# EAGLE design watch (EAGLE 7.0.0)
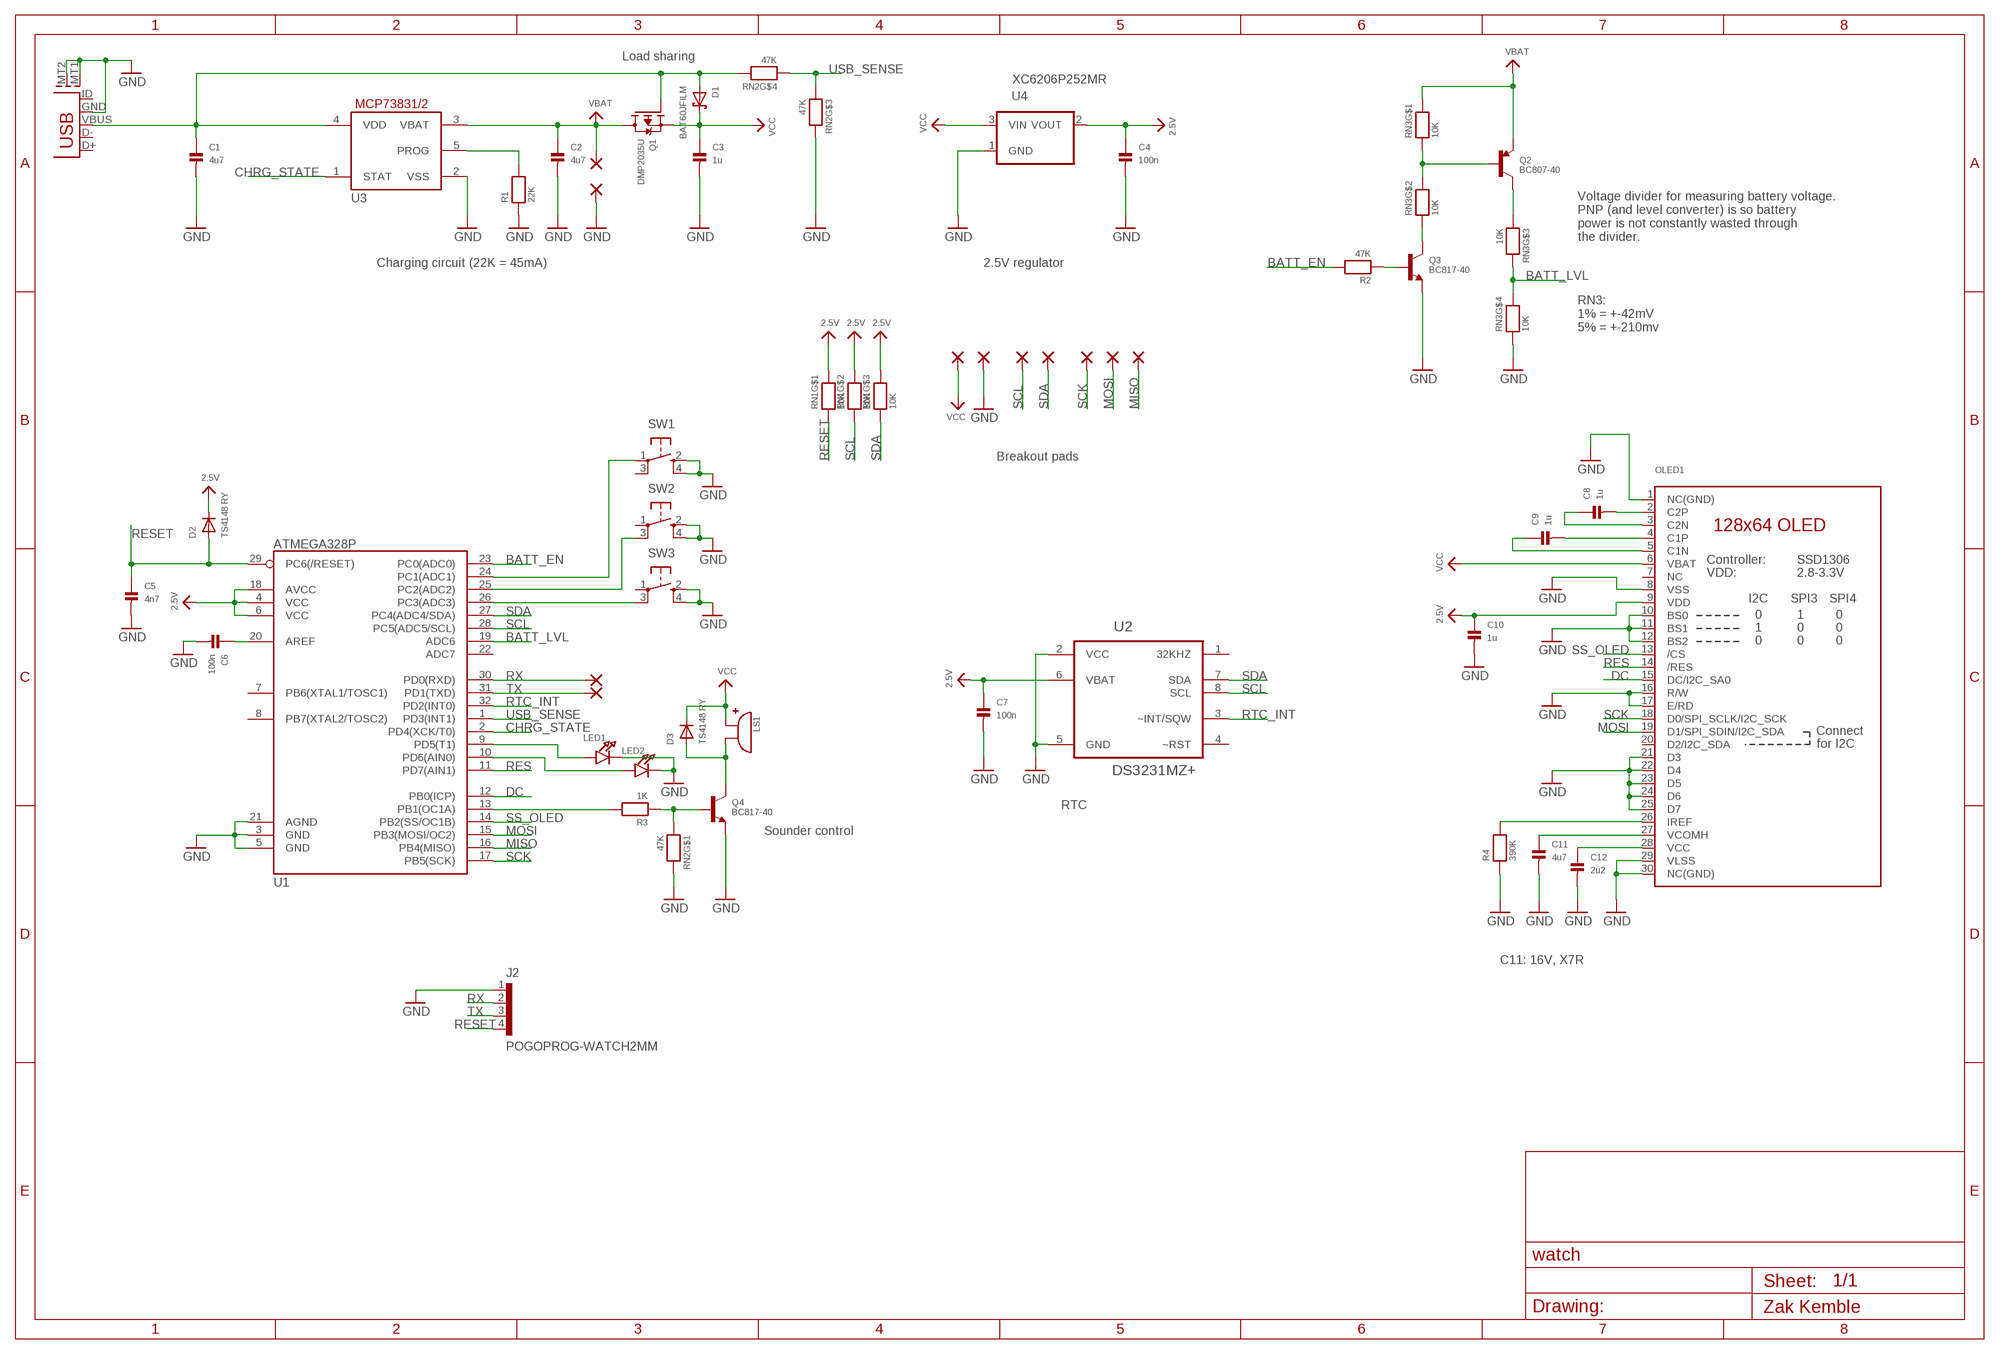
[diagram p0: schematic, sheet 1]

## Parts
C1  4u7  CAP_CERAMIC0805  [0805]
C2  4u7  CAP_CERAMIC0805  [0805]
C3  1u  CAP_CERAMIC0805  [0805]
C4  100n  CAP_CERAMIC0805  [0805]
C5  4n7  CAP_CERAMIC0805  [0805]
C6  100n  CAP_CERAMIC0805  [0805]
C7  100n  CAP_CERAMIC0805  [0805]
C8  1u  CAP_CERAMIC0805  [0805]
C9  1u  CAP_CERAMIC0805  [0805]
C10  1u  CAP_CERAMIC0805  [0805]
C11  4u7  CAP_CERAMIC0805  [0805]
C12  2u2  CAP_CERAMIC0805  [0805]
D1  BAT60JFILM  DIODE-SCHOTTKYSOD-323  [SOD-323]
D2  TS4148 RY  DIODE_08050805  [0805_DIODE]
D3  TS4148 RY  DIODE_08050805  [0805_DIODE]
J2  POGOPROG-WATCH2MM  [POGOPROG_WATCH_2MM]
LED1  LED0805  [CHIPLED_0805]
LED2  LED0805  [CHIPLED_0805]
LS1  ABMT-801-RC  [PIEZO]
OLED1  DISP_OLED_UG-2864HSWEG01_NOOUTLINEWATCH  [UG-2864HSWEG01_1.3_WRAPAROUND_WATCH]
PAD1  SMD2  [SMD1,27-2,54]
PAD2  SMD2  [SMD1,27-2,54]
PAD3  SMD2  [SMD1,27-2,54]
PAD4  SMD2  [SMD1,27-2,54]
PAD5  SMD2  [SMD1,27-2,54]
PAD6  SMD2  [SMD1,27-2,54]
PAD7  SMD2  [SMD1,27-2,54]
PAD8  SMD2  [SMD1,27-2,54]
PAD10  SMD2  [SMD1,27-2,54]
PAD11  SMD2  [SMD1,27-2,54]
PAD12  SMD2  [SMD1,27-2,54]
Q1  DMP2035U  MOSFET-PWIDE  [SOT23-WIDE]
Q2  BC807-40  TRANSISTOR_PNPWIDE  [SOT23-WIDE]
Q3  BC817-40  TRANSISTOR_NPNWIDE  [SOT23-WIDE]
Q4  BC817-40  TRANSISTOR_NPNWIDE  [SOT23-WIDE]
R1  22K  RESISTOR0805  [0805]
R2  47K  RESISTOR0805  [0805]
R3  1K  RESISTOR0805  [0805]
R4  390K  RESISTOR0805  [0805]
RN1  10K  RESISTOR_4PACK  [RESPACK_4X0603]
RN2  47K  RESISTOR_4PACK  [RESPACK_4X0603]
RN3  10K  RESISTOR_4PACK  [RESPACK_4X0603]
SW1  SPST_TACTRA  [TACT_SMD2]
SW2  SPST_TACTRA  [TACT_SMD2]
SW3  SPST_TACTRA  [TACT_SMD2]
U1  ATMEGA328P  ATMEGA328_SMT  [TQFP32-08]
U2  DS3231MZ+  DS3231MZ+SMPAD  [SOIC8_150MIL_SMPAD]
U3  MCP73832T-2ACI/OT  MCP73831/OT  [SOT23-5L]
U4  XC6206P252MR  MCP1700T-2502E/TTWIDE_PAD  [SOT-23]
USB1  USB-MICROBLARGEPAD  [USB-MICROB_LARGEPAD]

## Nets
2.5V: C4.1 C7.1 C10.1 D2.2(C) OLED1.9(VDD) RN1.6 RN1.7 RN1.8 U1.4(VCC) U1.6(VCC) U1.18(AVCC) U2.6(VBAT) U4.2(VOUT)
BATT_EN: R2.2 U1.23(PC0(ADC0))
BATT_LVL: RN3.5 RN3.6 U1.19(ADC6)
CHRG_STATE: U1.2(PD4(XCK/T0)) U3.1(STAT)
DC: OLED1.15(DC/I2C_SA0) U1.12(PB0(ICP))
GND: C1.2 C2.2 C3.2 C4.2 C5.2 C6.2 C7.2 C10.2 C11.2 C12.2 J2.1 LED1.C LED2.C OLED1.1(NC(GND)) OLED1.8(VSS) OLED1.10(BS0) OLED1.11(BS1) OLED1.12(BS2) OLED1.16(R/W) OLED1.17(E/RD) OLED1.21(D3) OLED1.22(D4) OLED1.23(D5) OLED1.24(D6) OLED1.25(D7) OLED1.29(VLSS) OLED1.30(NC(GND)) PAD2.1(P) PAD5.1(P) Q3.2(E) Q4.2(E) R1.1 R4.1 RN2.6 RN2.8 RN3.4 SW1.2(S) SW1.4(S1) SW2.2(S) SW2.4(S1) SW3.2(S) SW3.4(S1) U1.3(GND) U1.5(GND) U1.21(AGND) U2.2(VCC) U2.5(GND) U3.2(VSS) U4.1(GND) USB1.GND USB1.MT1(SHEILD1) USB1.MT2(SHEILD2)
MISO: PAD12.1(P) U1.16(PB4(MISO))
MOSI: OLED1.19(D1/SPI_SDIN/I2C_SDA) PAD11.1(P) U1.15(PB3(MOSI/OC2))
N$1: C6.1 U1.20(AREF)
N$2: SW1.1(P) U1.24(PC1(ADC1))
N$3: C8.2 OLED1.2(C2P)
N$4: SW3.3(P1) U1.26(PC3(ADC3))
N$5: OLED1.26(IREF) R4.2
N$6: C1.1 D1.A Q1.1(G) RN2.5 U3.4(VDD) USB1.VBUS
N$7: D3.1(A) LS1.2(GND) Q4.3(C)
N$8: Q4.1(B) R3.1 RN2.1
N$9: SW2.3(P1) U1.25(PC2(ADC2))
N$10: R1.2 U3.5(PROG)
N$11: LED1.A U1.9(PD5(T1))
N$12: Q2.1(B) RN3.1 RN3.7
N$13: C9.1 OLED1.5(C1N)
N$14: C9.2 OLED1.4(C1P)
N$15: C8.1 OLED1.3(C2N)
N$16: LED2.A U1.10(PD6(AIN0))
N$17: Q3.3(C) RN3.2
N$18: Q2.3(C) RN3.3
N$19: C11.1 OLED1.27(VCOMH)
N$20: C12.1 OLED1.28(VCC)
N$21: Q3.1(B) R2.1
PIEZO: R3.2 U1.13(PB1(OC1A))
RES: OLED1.14(/RES) U1.11(PD7(AIN1))
RESET: C5.1 D2.1(A) J2.4 RN1.1 U1.29(PC6(/RESET))
RTC_INT: U1.32(PD2(INT0)) U2.3(~INT/SQW)
RX: J2.2 PAD3.1(P) U1.30(PD0(RXD))
SCK: OLED1.18(D0/SPI_SCLK/I2C_SCK) PAD10.1(P) U1.17(PB5(SCK))
SCL: PAD8.1(P) RN1.2 U1.28(PC5(ADC5/SCL)) U2.8(SCL)
SDA: PAD7.1(P) RN1.3 U1.27(PC4(ADC4/SDA)) U2.7(SDA)
SS_OLED: OLED1.13(/CS) U1.14(PB2(SS/OC1B))
TX: J2.3 PAD4.1(P) U1.31(PD1(TXD))
USB_SENSE: RN2.3 RN2.4 U1.1(PD3(INT1))
VBAT: C2.1 PAD1.1(P) Q1.3(D) Q2.2(E) RN3.8 U3.3(VBAT)
VCC: C3.1 D1.C D3.2(C) LS1.1(VCC) OLED1.6(VBAT) PAD6.1(P) Q1.2(S) U4.3(VIN)
Unconnected: OLED1.7(NC) OLED1.20(D2/I2C_SDA) RN1.4 RN1.5 RN2.2 RN2.7 SW1.3(P1) SW2.1(P) SW3.1(P) U1.7(PB6(XTAL1/TOSC1)) U1.8(PB7(XTAL2/TOSC2)) U1.22(ADC7) U2.1(32KHZ) U2.4(~RST) USB1.D+ USB1.D- USB1.ID

## Notes on the sheet
- Load sharing
- Voltage divider for measuring battery voltage.
  PNP (and level converter) is so battery
  power is not constantly wasted through
  the divider.
- Charging circuit (22K = 45mA) | 2.5V regulator
- RN3:
  1% = +-42mV
  5% = +-210mv
- Breakout pads
- RTC
- Sounder control
- C11: 16V, X7R

## Library data of the parts
C1-C12 = microbuilder:CAP_CERAMIC: Ceramic Capacitors 0402 - 0402 Surface Mount Capacitors 16pF 50V 5% [Digikey: 445-4899-2-ND] 18pF 50V 5% [Digikey: 490-1281-2-ND] 22pF 50V 5% [Digikey: 490-1283-2-ND] 68pF 50V 5% [Digikey: 490-1289-2-ND] 0.1uF 10V 10% [Digikey: 490-1318-2-ND] 1.0uF 6.3V 10% [Digikey: 490-1320-2-ND] 0603 - 0603 Surface Mount Capacitors 16 pF 50V 5% [Digikey: 445-5051-2-ND] 22 pF 50V [Digikey: PCC220ACVTR-ND] 33 pF 50V 5% [Digikey: 490-1415-1-ND] 56pF 50V 5% [Digikey: 490-1421-1-ND] 220pF 50V 5% [Digikey: 445-1285-1-ND] 680 pF 50V 2200 pF 50V 5% C0G [Digikey: 445-1297-1-ND] 5600 pF 100V 5% X7R [Digikey: 478-3711-1-ND] 0.1 µF 25V 10% [Digikey: PCC2277TR-ND] 0.22 µF 16V 10% X7R [Digikey: 445-1318-1-ND] 1.0 µF 25V 10% [Digikey: 445-5146-2-ND] 0603 - RF Specific 3pF 250V +/-0.1pF RF [Digikey: 712-1347-1-ND] 18 pF 250V 5% [Digikey: 478-3505-1-ND or 712-1322-1-ND] 56 pF 250V 5% C0G RF [Digikey: 490-4867-1-ND] 68 pF 250V RF [Digikey: 490-4868-1-ND] 0805 - 0805 Surface Mount Capacitors 220 pF 250V 2% RF Ceramic Capacitor [Digikey: 712-1398-1-ND] 1000 pF 50V 2% NP0 Ceramic Capacitor [Digikey: 478-3760-1-ND] 0.1 µF 25V 10% Ceramic Capacitor [Digikey: PCC1828TR-ND] 1.0 µF 16V 10% Ceramic Capacitor[Digikey: 490-1691-2-ND] 10.0 µF 10V 10% Ceramic Capacitor[Digikey: 709-1228-1-ND] 10.0 uF 16V 10% Ceramic Capacitor [Digikey: 478-5165-2-ND] 47 uF 6.3V 20% Ceramic Capacitor [Digikey: 587-1779-1-ND or 399-5506-1-ND] 1206 - 1206 Surface Mount Capacitors 47uF 10V 20% Ceramic Capacitor [Digikey: 490-5528-1-ND or 399-5508-1-ND or 445-6010-1-ND] 100uF 6.3V -20%, +80% Y5V Ceramic Capacitor (Digikey: 490-4512-1-ND, Mouser: 81-GRM31CF50J107ZE1L)
D1 = zak:DIODE-SCHOTTKY
D2 D3 = zak:DIODE_0805: Diode in 0805 package
J2 = zak:POGOPROG-WATCH
LED1 LED2 = microbuilder:LED: LED 0603 - 0603 Surface Mount Package 2mA: Green LED - Low Power (3.9mcd, 2ma, 1.7Vf) - Digikey: 475-2709-2-ND Orange LED - Low Power (9.8mcd, 2ma, 1.8Vf) - Digikey: 475-1194-2-ND Red LED - Low Power (5mcd, 2ma, 1.8Vf) - Digikey: 475-1195-2-ND Yellow LED - Low Power (7mcd, 2ma, 1.8Vf) - Digikey: 475-1196-2-ND 5mA: Blue LED - Low Power (17mcd, 5ma, 2.9Vf) - Digikey: LNJ937W8CRACT-ND 0805 - 0805 Surface Mount Package 2mA: Red LED (8.8mcd, 2mA, 1.8Vf, Clear) - Low Power [Digikey: 475-2510-1-ND] Green LED (5mcd, 2mA, 1.8Vf, Clear) - Low Power [Digikey: 475-2730-1-ND] Yellow LED (11.3mcd, 2mA, 1.8Vf, Clear) - Low Power [Digikey: 475-2555-1-ND] 20mA: Red LED (104mcd, 20mA, Diffused) - LS R976 [Digikey: 475-1278-6-ND] Red LED (12mcd, 20mA, 2.0Vf, Clear) - APT2012EC [Digikey: 754-1128-1-ND] Green LED (15mcd, 20mA, 2.2Vf, Clear) - APT2012GC [Digikey: 754-1131-1-ND] Orange LED (160mcd, 20mA, 2.1Vf, Clear) - APT2012SECK [Digikey: 754-1130-1-ND] 1206 - 1206 Surface Mount Package Green LED (26mcd, 20mA, Diffused) - LG N971 [Digikey: 475-1407-6-ND] Red LED (15mcd, 20mA, Diffused) - LH N974 [Digikey: 475-1416-6-ND]
LS1 = zak:ABMT-801-RC
OLED1 = zak:DISP_OLED_UG-2864HSWEG01_NOOUTLINE
PAD1-PAD8 PAD10-PAD12 = wirepad:SMD2: SMD PAD
Q1 = microbuilder:MOSFET-P: P-Channel Mosfet LEGEND VDS: Voltage Drain-Source ID: Drain Current RDS(ON): Drain-Source On-State Resistance VGS(TH): Gate-Source Threshold Voltage CISS: Drain-Source Input Capacitance SOT-23 Name VDS ID RDS(ON) VGS(TH) CISS Order Number IRLML5103 30V 760mA 600 mOhm -- 75pF @ 25V Digikey: IRLML5103PBFCT-ND IRLML6401 12V 4.3A 50 mOhm 950mV @ 250µA 830pF @ 10V Digikey: IRLML6401PBFTR-ND NTR0202PL 20V 400mA 800 mOhm 2.3V @ 250uA 70pF @ 5V Digikey: NTR0202PLT1GOSTR-ND NTR4101PT1G 20V 1.8A 85 mOhm 1.2V @ 250uA 675pF @ 10V Digikey: NTR4101PT1GOSCT-ND DMP2004K 20V 600mA 900 mOhm 1V @ 250uA 175pF @ 16V Digikey: DMP2004KDICT-ND PMV65XP 20V 3.9A 76 mOhm 950mV @ 1mA 725pF @ 20V Digikey: 568-2358-2-ND TO-252 Name VDS ID RDS(ON) VGS(TH) CISS Order Number AOD417 30V 25A 34 mOhm 3V @ 250µA 920pF @ 15V Digikey: 785-1106-2-ND
Q2 = microbuilder:TRANSISTOR_PNP: PNP Transistor Transistor (PNP) 800mA 60V, 1.6V VCE @ 500mA [Digikey: MMBT2907AFSTR-ND] Transistor (PNP) Low Sat - 1.5A 20V, 260mV VCE @ 400mA [Digikey: ZXTP25020DFLTR-ND] SOT23-R - SOT23 footprint optimised for use with solder paste and reflow ovens. SOT23-W - SOT23 footprint optimised for hand-soldering (larger pads).
Q3 Q4 = microbuilder:TRANSISTOR_NPN: NPN Transistor Transistor (NPN) 500mA 45V - BC817 [Digikey: 568-1631-1-ND] Transistor (NPN) 500mA 45V - BC817,215 [Mouser: 771-BC817-T/R] SOT23-R - SOT23 footprint optimised for use with solder paste and reflow ovens. SOT23-W - SOT23 footprint optimised for hand-soldering (larger pads).
R1-R4 = microbuilder:RESISTOR: Resistors 0402 - 0402 Surface Mount Package 22 Ohm 1% 1/16W [Digikey: 311-22.0LRTR-ND] 33 Ohm 5% 1/16W 1.0K 5% 1/16W 1.5K 5% 1/16W 2.0K 1% 1/16W 10.0K 1% 1/16W [Digikey: 311-10.0KLRTR-ND] 10.0K 5% 1/16W [Digikey: RMCF0402JT10K0TR-ND] 12.1K 1% 1/16W [Digikey: 311-22.0LRTR-ND] 100.0K 5% 1/16W 0603 - 0603 Surface Mount Package 0 Ohm 1/10 Watt 1% Resistor 15 Ohm 1/10 Watt 1% Resistor 33 Ohm 1/10 Watt 1% Resistor 49.9 Ohm 1/10 Watt 1% Resistor 100 Ohm 1/10 Watt 1% Resistor 150 Ohm 1/10 Watt 1% Resistor 240 Ohm 1/10 Watt 1% Resistor 390 Ohm 1/10 Watt 1% Resistor 560 Ohm 1/10 Watt 1% Resistor 680 Ohm 1/10 Watt 1% Resistor 750 Ohm 1/10 Watt 1% Resistor 1.0K Ohm 1/10 Watt 1% Resistor 1.5K Ohm 1/10 Watt 1% Resistor 2.0K Ohm 1/10 Watt 1% Resistor 2.2K Ohm 1/10 Watt 1% Resistor 3.3K Ohm 1/10 Watt 1% Resistor 4.7K Ohm 1/10 Watt 1% Resistor 10.0K Ohm 1/10 Watt 1% Resistor 12.0K Ohm 1/10 Watt 1% Resistor 12.1K Ohm 1/10 Watt 1% Resistor 20.0K Ohm 1/10 Watt 1% Resistor 33.0K Ohm 1/10 Watt 1% Resistor 100.0K Ohm 1/10 Watt 1% Resistor 0805 - 0805 Surface Mount Package 0 Ohm 1/8 Watt 1% Resistor 33 Ohm 1/8 Watt 1% Resistor 100 Ohm 1/8 Watt 1% Resistor 150 Ohm 1/8 Watt 1% Resistor 200 Ohm 1/8 Watt 1% Resistor 240 Ohm 1/8 Watt 1% Resistor 330 Ohm 1/8 Watt 1% Resistor 390 Ohm 1/8 Watt 1% Resistor 470 Ohm 1/8 Watt 1% Resistor 1.0K Ohm 1/8 Watt 1% Resistor 1.5K Ohm 1/8 Watt 1% Resistor 2.0K Ohm 1/8 Watt 1% Resistor 4.7K Ohm 1/8 Watt 1% Resistor 5.1K Ohm 1/8 Watt 1% Resistor 5.6K Ohm 1/8 Watt 1% Resistor 10.0K Ohm 1/8 Watt 1% Resistor 22.0K Ohm 1/8 Watt 1% Resistor 33.0K Ohm 1/8 Watt 1% Resistor 100K Ohm 1/8 Watt 1% Resistor 1206 - 1206 Surface Mount Package 2012 - 2010 Surface Mount Package 0.11 Ohm 1/2 Watt 1% Resistor - Digikey: RHM.11UCT-ND
RN1-RN3 = microbuilder:RESISTOR_4PACK: Resistor Packs (4 resistors) 4 x 0603 10K 1/16W - Digikey: YC164J-10KCT-ND
SW1-SW3 = zak:SPST_TACT
U1 = SparkFun-DigitalIC:ATMEGA328_SMT: 32-Pin Atmega328 part Commonly used on Arduino compatible boards Available in QFP and QFN packages TQFP is IC-09069 QFN is non-stock; PROD_ID: IC-09069
U2 = zak:DS3231MZ+
U3 = adafruit:MCP73831: MCP73831/2 Miniature Single-Cell, Fully Integrated Li-Ion, Li-Polymer Charge Management Controllers. Nice and small simple lipoly charge controller, with adjustable current and status output (LED) http://www.ladyada.net/library/pcb/eaglelibrary.html
U4 = zak:MCP1700T-2502E/TT: Low Quiescent Current LDO
USB1 = zak:USB-MICROB

## Board
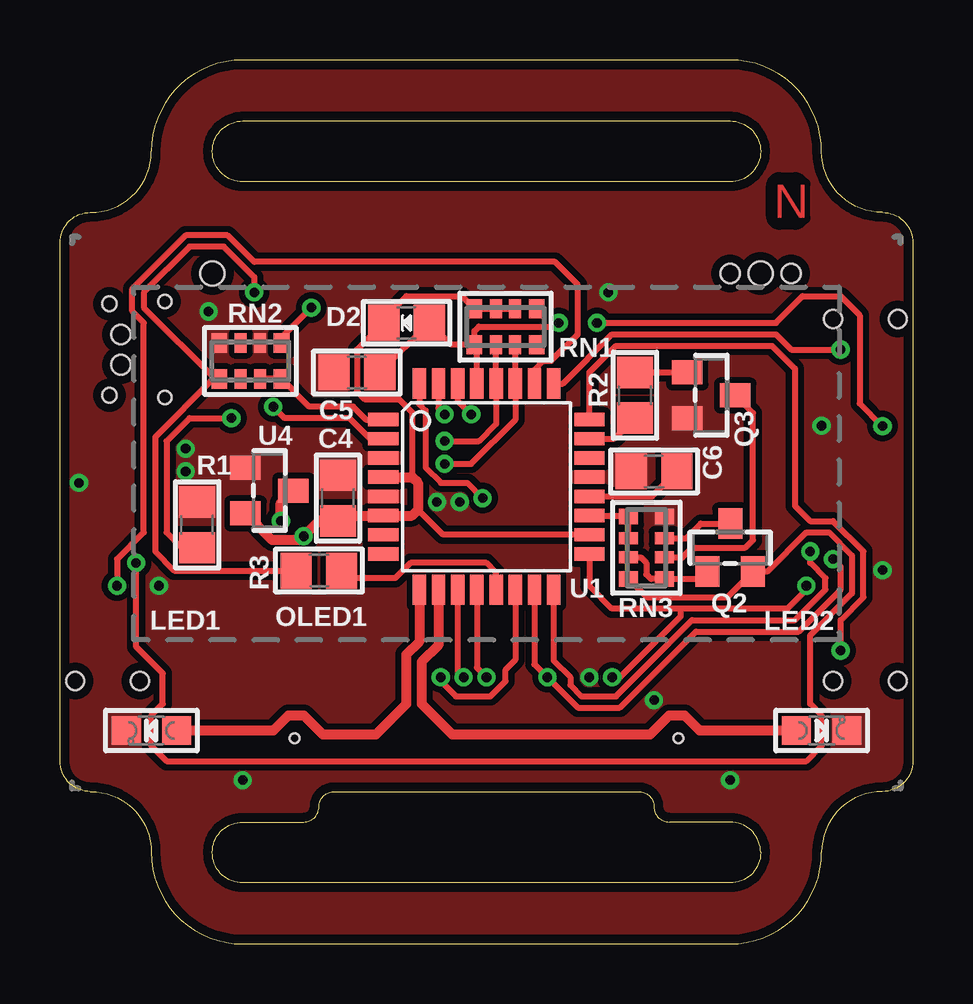
[diagram p1: board, top side]
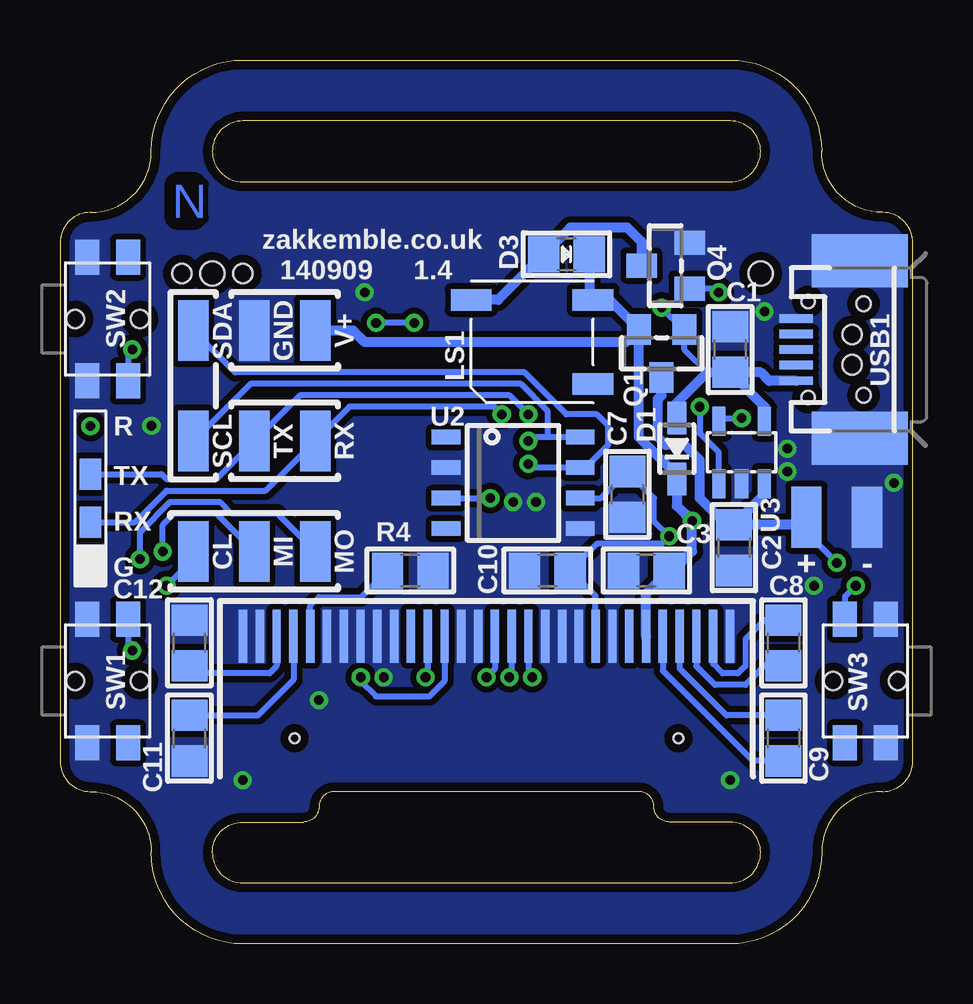
[diagram p2: board, bottom side, seen from below]

Size 35.56 x 36.83 mm. Coordinates in mm from the lower left corner, seen from the top.
Outline: 34.29,30.48 arc-90 35.56,29.21 35.56,7.62 arc-90 34.29,6.35 arc90 31.75,3.81 arc-90 27.94,0 7.62,0 arc-90 3.81,3.81 arc90 1.27,6.35 arc-90 0,7.62 0,29.21 arc-90 1.27,30.48 arc90 3.81,33.02 arc-90 7.62,36.83 27.94,36.83 arc-90 31.75,33.02 arc90 34.29,30.48
Outline: 7.62,2.54 arc-90 6.35,3.81 arc-90 7.62,5.08 10.16,5.08 arc90 10.79,5.71 arc-90 11.43,6.35 24.13,6.35 arc-90 24.76,5.71 arc90 25.4,5.08 27.94,5.08 arc-90 29.21,3.81 arc-90 27.94,2.54 7.62,2.54
Outline: 27.94,34.29 arc-90 29.21,33.02 arc-90 27.94,31.75 7.62,31.75 arc-90 6.35,33.02 arc-90 7.62,34.29 27.94,34.29
Copper layers (1*16): Top 0.0356mm / dielectric 1.5011mm / Bottom 0.0356mm
Design rules "LaenPCBOrder *": minimum track width 6mil, minimum drill 13mil, track to track 6mil, track to pad 6mil, pad to pad 6mil, via to via 6mil, smd to smd 6mil, copper to edge 15mil, drill to drill 6mil, minimum pad ring 7mil, minimum via ring 7mil, stop-mask expansion 4mil, vias tented up to drill 24mil, thermal gap 10mil
Holes 1 mm at 6.35,27.94 29.21,27.94
Holes 0.6 mm at 2.06,26.67 2.06,22.86
Holes 0.8 mm at 27.94,27.94 30.48,27.94 2.54,24.13 2.54,25.4
tRestrict: area 29.7,30 to 31,31.9
bRestrict: area 29.7,30 to 31,31.9

### Footprints (pad centres in the part's own frame; a part is rotated, then mirrored left to right if it is on the bottom)
0805 = smd 1.3 x 1.5: 1 -0.95,0; 2 0.95,0
SOD-323 = smd 1.35 x 0.8: A 1.27,0; C -1.27,0
0805_DIODE = smd 1.3 x 1.5: 1 -0.95,0; 2 0.95,0
POGOPROG_WATCH_2MM = drill 0.4: 1 0,3; 4 0,-3 | smd 0.889 x 1.3: 2 0,1; 3 0,-1
CHIPLED_0805 = smd 1.2 x 1.2: A 0,-1.05; C 0,1.05
PIEZO = smd 1.7 x 0.9: 1 -2.54,-1.75; 2 2.54,-1.75; 3 -2.54,1.75
UG-2864HSWEG01_1.3_WRAPAROUND_WATCH = smd 0.35 x 2.2 bottom: 1 -10.15,-1.153; 2 -9.45,-1.153; 3 -8.75,-1.153; 4 -8.05,-1.153; 5 -7.35,-1.153; 6 -6.65,-1.153; 7 -5.95,-1.153; 8 -5.25,-1.153; 9 -4.55,-1.153; 10 -3.85,-1.153; 11 -3.15,-1.153; 12 -2.45,-1.153; 13 -1.75,-1.153; 14 -1.05,-1.153; 15 -0.35,-1.153; 16 0.35,-1.153; 17 1.05,-1.153; 18 1.75,-1.153; 19 2.45,-1.153; 20 3.15,-1.153; 21 3.85,-1.153; 22 4.55,-1.153; 23 5.25,-1.153; 24 5.95,-1.153; 25 6.65,-1.153; 26 7.35,-1.153; 27 8.05,-1.153; 28 8.75,-1.153; 29 9.45,-1.153; 30 10.15,-1.153 | hole 0.4: -8,-5.402; 8,-5.402
SMD1,27-2,54 = smd 1.27 x 2.54: 1 0,0
SOT23-WIDE = smd 1 x 1.27: 1 -0.95,-1; 2 0.95,-1; 3 0,1
RESPACK_4X0603 = smd 0.65 x 0.8: 1 -1.3,-0.75; 4 1.3,-0.75; 5 1.3,0.75; 8 -1.3,0.75 | smd 0.5 x 0.8: 2 -0.4,-0.75; 3 0.4,-0.75; 6 0.4,0.75; 7 -0.4,0.75
TACT_SMD2 = smd 1.45 x 1: 1 -2.575,-0.5; 2 -2.575,-2.2; 3 2.575,-0.5; 4 2.575,-2.2 | hole 0.75: 0,0; 0,-2.7
TQFP32-08 = smd 1.27 x 0.559: 1 -4.293,2.8; 2 -4.293,2; 3 -4.293,1.2; 4 -4.293,0.4; 5 -4.293,-0.4; 6 -4.293,-1.2; 7 -4.293,-2; 8 -4.293,-2.8; 17 4.293,-2.8; 18 4.293,-2; 19 4.293,-1.2; 20 4.293,-0.4; 21 4.293,0.4; 22 4.293,1.2; 23 4.293,2; 24 4.293,2.8 | smd 0.559 x 1.27: 9 -2.8,-4.293; 10 -2,-4.293; 11 -1.2,-4.293; 12 -0.4,-4.293; 13 0.4,-4.293; 14 1.2,-4.293; 15 2,-4.293; 16 2.8,-4.293; 25 2.8,4.293; 26 2,4.293; 27 1.2,4.293; 28 0.4,4.293; 29 -0.4,4.293; 30 -1.2,4.293; 31 -2,4.293; 32 -2.8,4.293
SOIC8_150MIL_SMPAD = smd 0.6 x 1.2: 1 -1.905,-2.8; 2 -0.635,-2.8; 3 0.635,-2.8; 4 1.905,-2.8; 5 1.905,2.8; 6 0.635,2.8; 7 -0.635,2.8; 8 -1.905,2.8
SOT23-5L = smd 0.55 x 1.2: 1 -0.95,-1.3; 2 0,-1.3; 3 0.95,-1.3; 4 0.95,1.3; 5 -0.95,1.3
SOT-23 = smd 1 x 1.27: 1 -0.95,-1; 2 0.95,-1; 3 0,1
USB-MICROB_LARGEPAD = smd 0.35 x 1.4: D+ 0,2.65; D- -0.65,2.65; GND 1.3,2.65; ID 0.65,2.65; VBUS -1.3,2.65 | smd 2.2 x 4: MT1 -3.7,0; MT2 3.7,0 | hole 0.55: -2,2.15; 2,2.15

### Placement (x,y rotation side)
C1  7.62,24.77 90 bottom
C2  7.46,16.51 270 bottom
C3  11.11,15.56 180 bottom
C4  11.59,18.57 90 top
C5  12.38,23.81 180 top
C6  24.76,19.68 180 top
C7  11.91,18.73 270 bottom
C8  5.4,12.54 90 bottom
C9  5.4,8.57 90 bottom
C10  15.24,15.56 180 bottom
C11  30.16,8.57 270 bottom
C12  30.16,12.54 90 bottom
D1  9.84,20.64 90 bottom
D2  14.45,25.88 180 top
D3  14.45,28.73 0 bottom
J2  34.29,18.57 180 bottom
LED1  3.81,8.89 90 top
LED2  31.75,8.89 270 top
LS1  15.88,25.08 180 bottom
OLED1  17.78,13.97 0 top
PAD1  4.45,17.78 0 bottom
PAD2  1.91,17.78 0 bottom
PAD3  24.92,20.95 180 bottom
PAD4  27.46,20.95 180 bottom
PAD5  27.46,25.56 180 bottom
PAD6  24.92,25.56 180 bottom
PAD7  30,25.56 0 bottom
PAD8  30,20.95 0 bottom
PAD10  30,16.35 0 bottom
PAD11  24.92,16.35 0 bottom
PAD12  27.46,16.35 0 bottom
Q1  10.48,24.61 180 bottom
Q2  27.94,16.51 0 top
Q3  27.15,22.86 270 top
Q4  10.32,28.26 90 bottom
R1  5.71,17.46 270 top
R2  23.97,22.86 270 top
R3  10.79,15.56 0 top
R4  20.95,15.56 180 bottom
RN1  18.57,25.72 0 top
RN2  7.94,24.29 0 top
RN3  24.45,16.51 90 top
SW1  32.23,10.95 270 bottom
SW2  32.23,26.04 270 bottom
SW3  3.33,10.95 90 bottom
U1  17.78,19.05 0 top
U2  16.67,19.21 270 bottom
U3  7.14,20.48 0 bottom
U4  8.73,18.89 270 top
USB1  2.22,24.77 90 bottom

### Tracks (layer width: path | path; a pad name or v marks a point on that pad's centre or on a via)
2.5V  (via drill 0.4)
  Top 0.254: U1.18 15.97,17.05 14.92,18.1 | RN1.6 RN1.7 RN1.8 16.75,26.99 14.45,26.99 13.5,26.04 D2.2 12.38,24.76 12.38,23.02 12.7,22.7 14.13,22.7 14.68,22.15 14.68,19.45
  Top 0.406: U4.2 8.84,16.83 10,16.83 v10.16,16.99 10.8,17.62 C4.1 11.81,17.85 U1.6 14.67,17.85 14.92,18.1 14.92,19.21 14.68,19.45 U1.4
  Bottom 0.254: OLED1.9 13.23,14.5 C10.1 13.18,16.67 10.48,16.67 v10.16,16.99 10.79,17.62 10.79,18.57 C7.1 13.02,18.57 U2.6
BATT_EN
  Top 0.254: U1.23 23.11,21.05 R2.2
BATT_LVL
  Top 0.254: U1.19 23.66,17.85 RN3.5 RN3.6
CHRG_STATE  (via drill 0.4)
  Top 0.254: U1.2 12.92,21.05 12.06,21.91 9.37,21.91 v8.89,22.38
  Bottom 0.254: U3.1 8.09,20.48 8.89,21.27 v8.89,22.38
DC  (via drill 0.4)
  Top 0.254: U1.12 17.38,11.51 v17.78,11.11
  Bottom 0.254: OLED1.15 17.43,11.46 v17.78,11.11
GND  (via drill 0.4)
  other vias: 7.62,6.83 27.94,6.83 5.24,20.64 5.24,19.68 16.67,18.41 15.72,18.41 4.13,14.92 22.86,27.15 6.19,26.35 0.79,19.21 31.75,21.59 24.76,10.16 22.07,11.11
  pour Bottom (isolate 0.254, no thermals): 0,36.83 35.56,36.83 35.56,0 0,0
  pour Top (isolate 0.254, no thermals): 0,36.83 35.56,36.83 35.56,0 0,0
MISO  (via drill 0.4)
  Top 0.254: U1.16 20.58,11.8 21.27,11.11 21.27,10.79 21.75,10.32 23.18,10.32 26.35,13.49 30.64,13.49 31.91,14.76 31.91,15.24 31.27,15.88 v31.27,16.35
  Bottom 0.254: v31.27,16.35 31.27,17.46 30.8,17.94 29.05,17.94 PAD12.1
MOSI  (via drill 0.4)
  Top 0.254: U1.15 19.78,11.65 v20.32,11.11 21.59,9.84 23.34,9.84 26.51,13.02 30.8,13.02 32.54,14.76 32.54,15.72 v32.23,16.03
  Bottom 0.254: OLED1.19 20.23,11.2 v20.32,11.11 | v32.23,16.03 32.23,17.14 30.96,18.41 28.89,18.41 28.42,17.94 26.51,17.94 PAD11.1
N$1
  Top 0.254: U1.20 24.68,18.65 C6.1
N$2  (via drill 0.4)
  Top 0.254: U1.24 22.07,23.82 23.18,24.92 29.69,24.92 30.64,23.97 30.64,18.26 31.27,17.62 32.23,17.62 33.5,16.35 33.5,14.45 32.54,13.49 v32.54,12.22
  Bottom 0.254: SW1.1 32.73,12.41 v32.54,12.22
N$3
  Bottom 0.254: C8.2 6.19,13.49 6.98,12.7 6.98,11.59 7.3,11.27 7.94,11.27 8.33,11.66 OLED1.2
N$4  (via drill 0.4)
  Top 0.254: U1.26 19.78,23.91 20.16,24.29 20.48,24.29 21.59,25.4 21.59,27.46 20.64,28.42 8.1,28.42 6.98,29.53 5.24,29.53 3.02,27.3 3.02,26.35 3.49,25.88 3.49,17.14 2.38,16.03 v2.38,14.92
  Bottom 0.254: v2.38,14.92 2.83,14.47 SW3.3
N$5
  Bottom 0.254: OLED1.26 25.13,14.08 24.76,14.45 23.02,14.45 R4.2
N$6  (via drill 0.4)
  Top 0.254: RN2.5 9.24,25.27 v10.48,26.51
  Bottom 0.254: 8.57,23.81 9.53,24.77 Q1.1 9.57,25.61 v10.48,26.51
  Bottom 0.406: USB1.VBUS 6,23.46 6.35,23.81 C1.1 | U3.4 6.19,22.39 C1.1 | C1.1 8.57,23.81 9.84,22.54 D1.A
N$7
  Bottom 0.406: Q4.3 11.32,29.26 11.91,29.84 14.28,29.84 D3.1 17.3,26.83 LS1.2
N$8  (via drill 0.4)
  Top 0.254: RN2.1 6.62,23.54 | RN2.1 6.39,23.54 3.97,21.11 3.97,16.35 4.76,15.56 R3.1 | RN2.1 6.46,23.54 3.49,26.51 3.49,27.15 5.4,29.05 6.83,29.05 8.1,27.78 v8.1,27.15
  Bottom 0.254: v8.1,27.15 8.26,27.31 Q4.1
N$9  (via drill 0.4)
  Top 0.254: U1.25 20.96,23.34 23.02,25.4 29.84,25.4 30.48,24.77 v32.54,24.77
  Bottom 0.254: v32.54,24.77 32.73,24.58 SW2.3
N$10  (via drill 0.4)
  Top 0.254: v7.14,21.91 5.4,21.91 4.45,20.95 4.45,17.14 5.08,16.51 6.03,16.51 R1.2
  Bottom 0.254: U3.5 7.96,21.91 v7.14,21.91
N$11
  Top 0.406: LED1.A 8.89,8.89 9.52,9.53 10.16,9.53 10.95,8.73 13.18,8.73 14.45,10 14.45,12.06 14.98,12.6 U1.9
N$12
  Top 0.254: RN3.7 24.21,16.11 24.45,15.88 24.45,15.4 24.64,15.21 RN3.1 26.69,15.21 Q2.1
N$13
  Bottom 0.254: C9.1 6.67,7.62 10.43,11.38 OLED1.5
N$14
  Bottom 0.254: C9.2 7.78,9.52 9.73,11.48 OLED1.4
N$15
  Bottom 0.254: C8.1 6.19,11.59 6.98,10.79 8.25,10.79 9.03,11.57 OLED1.3
N$16
  Top 0.406: LED2.A 26.67,8.89 26.04,9.53 25.4,9.53 24.61,8.73 16.35,8.73 15.08,10 15.08,11.75 15.78,12.45 U1.10
N$17
  Top 0.254: RN3.2 25.95,16.11 26.35,16.51 28.57,16.51 28.89,16.83 28.89,22.11 Q3.3
N$18
  Top 0.254: RN3.3 26.12,16.91 26.72,17.51 Q2.3
N$19
  Bottom 0.254: OLED1.27 25.83,11 27.31,9.52 C11.1
N$20
  Bottom 0.254: OLED1.28 26.53,11.57 26.83,11.27 29.84,11.27 C12.1
N$21
  Top 0.254: R2.1 Q3.1
PIEZO
  Top 0.254: U1.13 18.18,15.47 17.78,15.88 14.6,15.88 13.97,15.24 12.06,15.24 R3.2
RES  (via drill 0.4)
  Top 0.254: U1.11 16.58,11.36 v16.83,11.11
  Bottom 0.254: OLED1.14 16.73,11.21 v16.83,11.11
RESET  (via drill 0.4)
  Top 0.254: U1.29 17.38,25.18 RN1.1 | RN1.1 17.27,25.53 17.46,25.72 20.64,25.72 v20.8,25.88 | RN1.1 16.3,24.97 D2.1 C5.1 | v22.38,25.88 29.84,25.88 30.96,26.99 32.54,26.99 33.34,26.19 33.34,22.53 J2.4
  Bottom 0.254: v20.8,25.88 v22.38,25.88
RTC_INT  (via drill 0.4)
  Top 0.254: U1.32 14.98,22.48 15.24,22.23 15.24,19.84 15.88,19.21 16.99,19.21 v17.62,18.57
  Bottom 0.254: U2.3 v17.62,18.57
RX  (via drill 0.4)
  Top 0.254: U1.30 16.58,22.63 v17.15,22.07
  Bottom 0.254: v17.15,22.07 17.46,22.38 23.49,22.38 PAD3.1 26.99,18.89 31.12,18.89 32.43,17.57 J2.2
SCK  (via drill 0.4)
  Top 0.254: 25.88,13.97 30.32,13.97 31.12,14.76 v31.12,14.92 | 25.88,13.97 23.02,13.97 22.07,14.92 U1.17 | v23.02,11.11 23.34,11.11 25.88,13.65 25.88,13.97
  Bottom 0.254: OLED1.18 19.53,10.95 20.16,10.32 22.38,10.32 23.02,10.95 v23.02,11.11 | v31.12,14.92 30,16.03 PAD10.1
SCL  (via drill 0.4)
  Top 0.254: U1.28 RN1.2 | v16.03,20.95 17.46,20.95 18.18,21.67 U1.28
  Top 0.406: U1.28
  Bottom 0.254: U2.8 15.24,21.11 | 15.24,21.11 15.88,21.11 v16.03,20.95 | 15.24,21.11 15.24,22.23 16.35,23.34 27.62,23.34 PAD8.1
SDA  (via drill 0.4)
  Top 0.254: RN1.3 U1.27 18.98,21.84 17.15,20 v16.03,20
  Bottom 0.254: v16.03,20 15.88,19.84 U2.7 13.65,19.84 12.7,20.8 12.7,21.59 13.18,22.07 14.45,22.07 16.19,23.81 28.26,23.81 PAD7.1
SS_OLED  (via drill 0.4)
  Top 0.254: U1.14 18.98,11.84 18.57,11.43 18.57,10.95 17.94,10.32 16.51,10.32 15.88,10.95 v15.88,11.11
  Bottom 0.254: OLED1.13 16.03,11.27 v15.88,11.11
TX  (via drill 0.4)
  Top 0.254: U1.31 15.78,22.32 v16.03,22.07
  Bottom 0.254: v16.03,22.07 16.83,22.86 25.56,22.86 PAD4.1 29.05,19.37 31.12,19.37 31.32,19.57 J2.3
USB_SENSE
  Top 0.254: RN2.3 RN2.4 10.39,22.38 12.22,22.38 12.76,21.85 U1.1
VBAT  (via drill 0.4)
  Top 0.254: v3.17,15.88 3.17,12.38 4.29,11.27 4.29,10 3.81,9.53 3.81,8.26 4.45,7.62 31.12,7.62 31.75,8.26 31.75,9.53 31.27,10 31.27,12.86 33.02,14.61 33.02,16.19 32.07,17.14 31.12,17.14 29.48,15.51 Q2.2 27.83,14.45 24.46,14.45 RN3.8
  Bottom 0.254: v3.17,15.88 4.45,17.14 PAD1.1
  Bottom 0.406: U3.3 6.19,18.73 C2.1 | PAD1.1 4.77,17.46 C2.1 | C2.1 7.78,17.46 8.89,18.57 8.89,20.16 9.52,20.8 10.32,20.8 10.64,21.11 10.64,22.7 10.48,22.86 Q1.3
VCC  (via drill 0.4)
  Top 0.406: v9.21,17.62 9.21,18.37 U4.3
  Bottom 0.406: C3.1 11.13,14.59 OLED1.6 | C3.1 | C3.1 9.84,15.56 9.84,15.72 9.21,16.35 v9.21,17.62 | v9.21,17.62 9.52,17.94 | v9.21,17.62 9.84,18.26 D1.C 9.84,19.53 11.43,21.11 Q1.2 | 24.76,25.4 PAD6.1 23.34,25.56 22.86,25.08 11.95,25.08 Q1.2 | Q1.2 12.65,26.83 LS1.1 13.5,26.99 D3.2

### Text on the board
Top: N
Bottom: N
bPlace: zakkemble.co.uk | 1.4 | 140909 | V+ | GND | SDA | R | RX | TX | SCL | TX | RX | - | + | MO | MI | CL | G
bStop: N | N|Watch